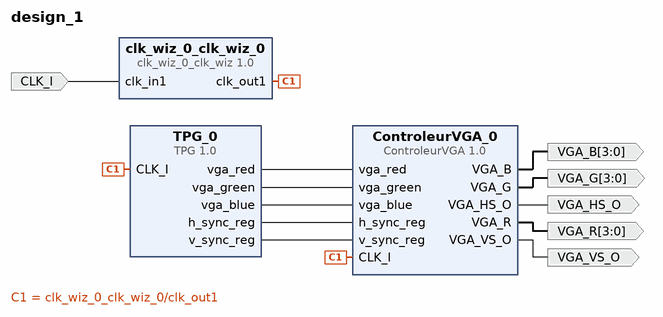
[diagram p0: block diagram of the top level]
# Vivado block design design_1, xc7z007sclg400-1, Vivado 2020.2
create_bd_design design_1

create_bd_port -dir O -from 3 -to 0 VGA_R
create_bd_port -dir O -from 3 -to 0 VGA_B
create_bd_port -dir O VGA_HS_O
create_bd_port -dir O VGA_VS_O
create_bd_port -dir O -from 3 -to 0 VGA_G
create_bd_port -dir I CLK_I

create_bd_cell -type ip -vlnv user.org:user:ControleurVGA:1.0 ControleurVGA_0
create_bd_cell -type ip -vlnv user.org:user:TPG:1.0 TPG_0
create_bd_cell -type ip -vlnv user.org:user:clk_wiz_0_clk_wiz:1.0 clk_wiz_0_clk_wiz_0

# ---- connections ----

connect_bd_net [get_bd_pins TPG_0/vga_red] [get_bd_pins ControleurVGA_0/vga_red]
connect_bd_net [get_bd_pins TPG_0/vga_green] [get_bd_pins ControleurVGA_0/vga_green]
connect_bd_net [get_bd_pins TPG_0/vga_blue] [get_bd_pins ControleurVGA_0/vga_blue]
connect_bd_net [get_bd_pins TPG_0/h_sync_reg] [get_bd_pins ControleurVGA_0/h_sync_reg]
connect_bd_net [get_bd_pins TPG_0/v_sync_reg] [get_bd_pins ControleurVGA_0/v_sync_reg]
connect_bd_net [get_bd_pins ControleurVGA_0/VGA_R] [get_bd_ports VGA_R]
connect_bd_net [get_bd_pins ControleurVGA_0/VGA_B] [get_bd_ports VGA_B]
connect_bd_net [get_bd_pins ControleurVGA_0/VGA_HS_O] [get_bd_ports VGA_HS_O]
connect_bd_net [get_bd_pins ControleurVGA_0/VGA_VS_O] [get_bd_ports VGA_VS_O]
connect_bd_net [get_bd_pins ControleurVGA_0/VGA_G] [get_bd_ports VGA_G]
connect_bd_net -net top_pll_0_clk_out [get_bd_pins clk_wiz_0_clk_wiz_0/clk_out1] [get_bd_pins TPG_0/CLK_I] [get_bd_pins ControleurVGA_0/CLK_I]
connect_bd_net [get_bd_ports CLK_I] [get_bd_pins clk_wiz_0_clk_wiz_0/clk_in1]

validate_bd_design
save_bd_design
